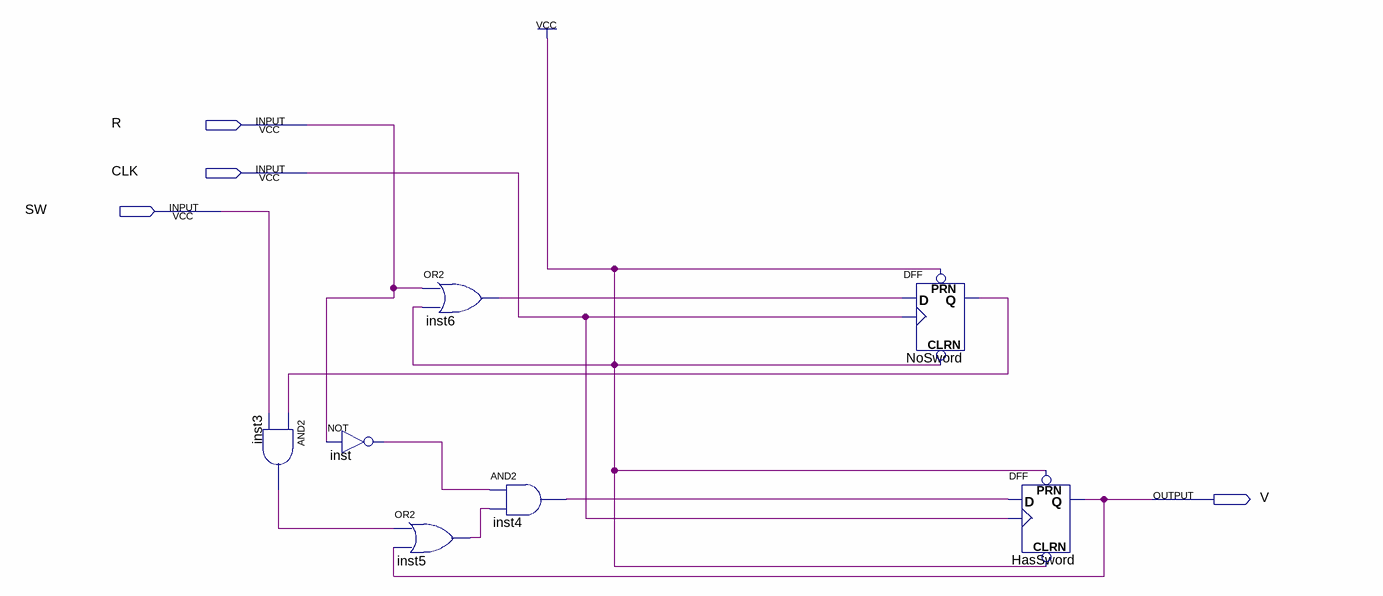
[diagram p0: schematic sheet]
// Quartus schematic SWORD_FSM.bdf as structural Verilog: 7 symbols, 4 pins
module SWORD_FSM (
  input  R,
  input  CLK,
  input  SW,
  output V
);

  wire inst3_out, inst4_out, inst5_out, inst6_out, inst_out, NoSword_q;

  and inst3 (inst3_out, NoSword_q, SW);
  not inst (inst_out, R);
  or inst5 (inst5_out, inst3_out, V);
  or inst6 (inst6_out, R, 1'b1);
  and inst4 (inst4_out, inst_out, inst5_out);
  DFF NoSword (.CLRN(1'b1), .CLK(CLK), .D(inst6_out), .PRN(1'b1), .Q(NoSword_q));
  DFF HasSword (.CLRN(1'b1), .CLK(CLK), .D(inst4_out), .PRN(1'b1), .Q(V));
endmodule
